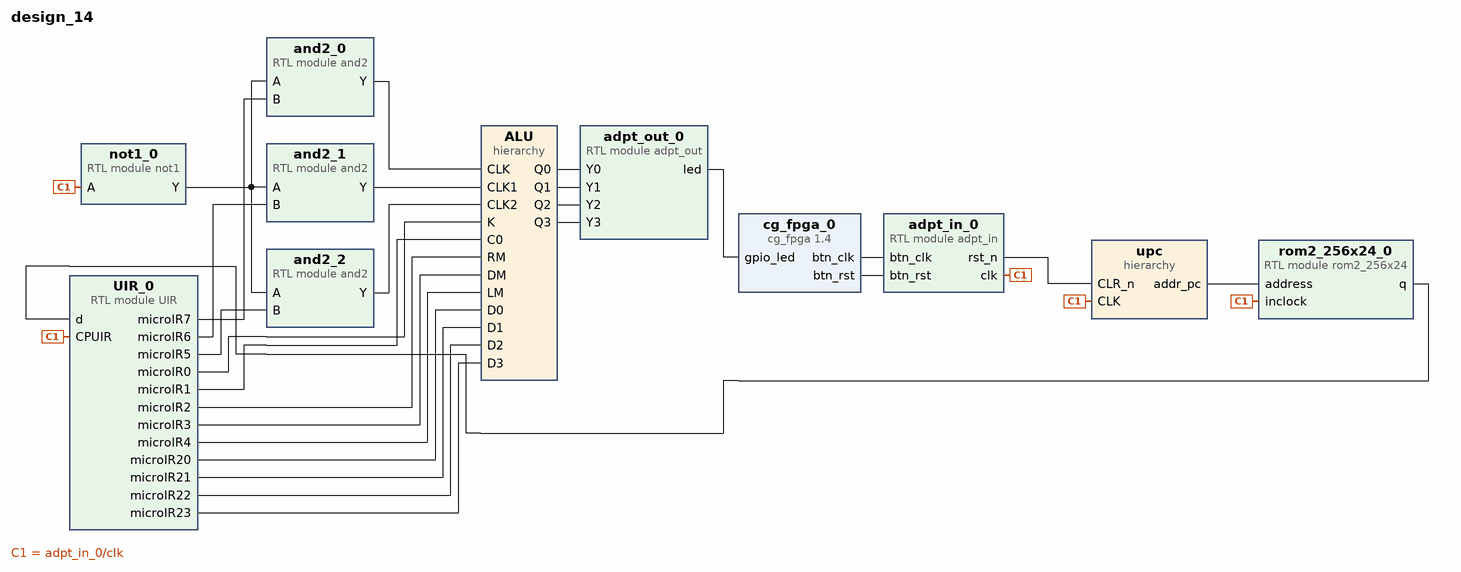
[diagram p0: block diagram of the top level]
# Vivado block design design_14, xc7z020clg400-1, Vivado 2024.2
create_bd_design design_14

create_bd_cell -type ip -vlnv educg.net:user:cg_fpga:1.4 cg_fpga_0
create_bd_cell -type module -reference rom2_256x24 rom2_256x24_0
create_bd_cell -type module -reference UIR UIR_0
create_bd_cell -type module -reference adpt_in adpt_in_0
create_bd_cell -type module -reference adpt_out adpt_out_0
create_bd_cell -type module -reference and2 and2_0
create_bd_cell -type module -reference not1 not1_0
create_bd_cell -type hier ALU
create_bd_cell -type hier upc
create_bd_cell -type module -reference and2 and2_1
create_bd_cell -type module -reference and2 and2_2

# ---- hierarchy /ALU ----
current_bd_instance /ALU
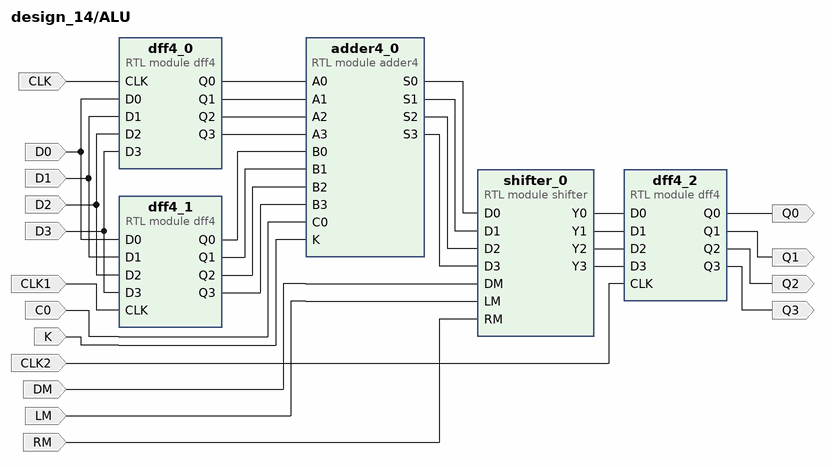
[diagram p1: block diagram inside /ALU]
create_bd_pin -dir I D0
create_bd_pin -dir I D1
create_bd_pin -dir I D2
create_bd_pin -dir I D3
create_bd_pin -dir I LM
create_bd_pin -dir I DM
create_bd_pin -dir I RM
create_bd_pin -dir I C0
create_bd_pin -dir I -type clk CLK
create_bd_pin -dir I -type clk CLK1
create_bd_pin -dir I -type clk CLK2
create_bd_pin -dir I K
create_bd_pin -dir O Q3
create_bd_pin -dir O Q2
create_bd_pin -dir O Q1
create_bd_pin -dir O Q0

create_bd_cell -type module -reference shifter shifter_0
create_bd_cell -type module -reference dff4 dff4_0
create_bd_cell -type module -reference adder4 adder4_0
create_bd_cell -type module -reference dff4 dff4_2
create_bd_cell -type module -reference dff4 dff4_1

# ---- hierarchy /upc ----
current_bd_instance /upc
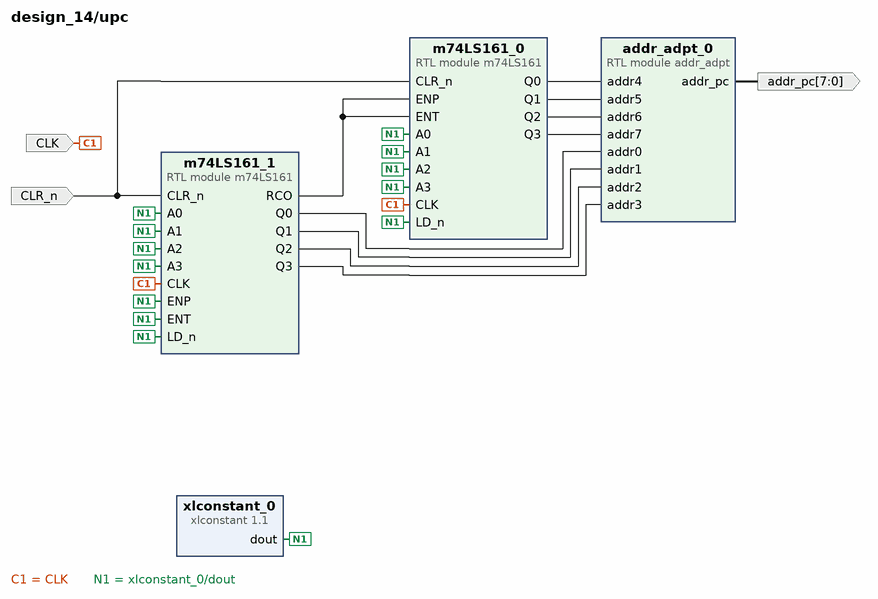
[diagram p2: block diagram inside /upc]
create_bd_pin -dir O -from 7 -to 0 addr_pc
create_bd_pin -dir I -type clk CLK
create_bd_pin -dir I CLR_n

create_bd_cell -type module -reference m74LS161 m74LS161_0
create_bd_cell -type module -reference addr_adpt addr_adpt_0
create_bd_cell -type module -reference m74LS161 m74LS161_1
create_bd_cell -type ip -vlnv xilinx.com:ip:xlconstant:1.1 xlconstant_0

# ---- connections ----

current_bd_instance /ALU
connect_bd_net -net C0_1 [get_bd_pins C0] [get_bd_pins adder4_0/C0]
connect_bd_net -net CLK1_1 [get_bd_pins CLK1] [get_bd_pins dff4_1/CLK]
connect_bd_net -net CLK2_1 [get_bd_pins CLK2] [get_bd_pins dff4_2/CLK]
connect_bd_net [get_bd_pins CLK] [get_bd_pins dff4_0/CLK]
connect_bd_net -net D0_1 [get_bd_pins D0] [get_bd_pins dff4_0/D0] [get_bd_pins dff4_1/D0]
connect_bd_net -net D1_1 [get_bd_pins D1] [get_bd_pins dff4_0/D1] [get_bd_pins dff4_1/D1]
connect_bd_net -net D2_1 [get_bd_pins D2] [get_bd_pins dff4_0/D2] [get_bd_pins dff4_1/D2]
connect_bd_net -net D3_1 [get_bd_pins D3] [get_bd_pins dff4_0/D3] [get_bd_pins dff4_1/D3]
connect_bd_net [get_bd_pins DM] [get_bd_pins shifter_0/DM]
connect_bd_net [get_bd_pins K] [get_bd_pins adder4_0/K]
connect_bd_net [get_bd_pins LM] [get_bd_pins shifter_0/LM]
connect_bd_net [get_bd_pins RM] [get_bd_pins shifter_0/RM]
connect_bd_net [get_bd_pins adder4_0/S0] [get_bd_pins shifter_0/D0]
connect_bd_net [get_bd_pins adder4_0/S1] [get_bd_pins shifter_0/D1]
connect_bd_net [get_bd_pins adder4_0/S2] [get_bd_pins shifter_0/D2]
connect_bd_net [get_bd_pins adder4_0/S3] [get_bd_pins shifter_0/D3]
connect_bd_net [get_bd_pins dff4_0/Q0] [get_bd_pins adder4_0/A0]
connect_bd_net [get_bd_pins dff4_0/Q1] [get_bd_pins adder4_0/A1]
connect_bd_net [get_bd_pins dff4_0/Q2] [get_bd_pins adder4_0/A2]
connect_bd_net [get_bd_pins dff4_0/Q3] [get_bd_pins adder4_0/A3]
connect_bd_net [get_bd_pins dff4_1/Q0] [get_bd_pins adder4_0/B0]
connect_bd_net [get_bd_pins dff4_1/Q1] [get_bd_pins adder4_0/B1]
connect_bd_net [get_bd_pins dff4_1/Q2] [get_bd_pins adder4_0/B2]
connect_bd_net [get_bd_pins dff4_1/Q3] [get_bd_pins adder4_0/B3]
connect_bd_net [get_bd_pins dff4_2/Q0] [get_bd_pins Q0]
connect_bd_net [get_bd_pins dff4_2/Q1] [get_bd_pins Q1]
connect_bd_net [get_bd_pins dff4_2/Q2] [get_bd_pins Q2]
connect_bd_net [get_bd_pins dff4_2/Q3] [get_bd_pins Q3]
connect_bd_net [get_bd_pins shifter_0/Y0] [get_bd_pins dff4_2/D0]
connect_bd_net [get_bd_pins shifter_0/Y1] [get_bd_pins dff4_2/D1]
connect_bd_net [get_bd_pins shifter_0/Y2] [get_bd_pins dff4_2/D2]
connect_bd_net [get_bd_pins shifter_0/Y3] [get_bd_pins dff4_2/D3]

current_bd_instance /upc
connect_bd_net [get_bd_pins CLK] [get_bd_pins m74LS161_0/CLK] [get_bd_pins m74LS161_1/CLK]
connect_bd_net [get_bd_pins CLR_n] [get_bd_pins m74LS161_0/CLR_n] [get_bd_pins m74LS161_1/CLR_n]
connect_bd_net [get_bd_pins addr_adpt_0/addr_pc] [get_bd_pins addr_pc]
connect_bd_net [get_bd_pins m74LS161_0/Q0] [get_bd_pins addr_adpt_0/addr4]
connect_bd_net [get_bd_pins m74LS161_0/Q1] [get_bd_pins addr_adpt_0/addr5]
connect_bd_net [get_bd_pins m74LS161_0/Q2] [get_bd_pins addr_adpt_0/addr6]
connect_bd_net [get_bd_pins m74LS161_0/Q3] [get_bd_pins addr_adpt_0/addr7]
connect_bd_net [get_bd_pins m74LS161_1/Q0] [get_bd_pins addr_adpt_0/addr0]
connect_bd_net [get_bd_pins m74LS161_1/Q1] [get_bd_pins addr_adpt_0/addr1]
connect_bd_net [get_bd_pins m74LS161_1/Q2] [get_bd_pins addr_adpt_0/addr2]
connect_bd_net [get_bd_pins m74LS161_1/Q3] [get_bd_pins addr_adpt_0/addr3]
connect_bd_net [get_bd_pins m74LS161_1/RCO] [get_bd_pins m74LS161_0/ENP] [get_bd_pins m74LS161_0/ENT]
connect_bd_net [get_bd_pins xlconstant_0/dout] \
  [get_bd_pins m74LS161_0/LD_n] [get_bd_pins m74LS161_0/A3] [get_bd_pins m74LS161_0/A2] [get_bd_pins m74LS161_0/A1] \
  [get_bd_pins m74LS161_0/A0] [get_bd_pins m74LS161_1/ENP] [get_bd_pins m74LS161_1/ENT] [get_bd_pins m74LS161_1/LD_n] \
  [get_bd_pins m74LS161_1/A3] [get_bd_pins m74LS161_1/A2] [get_bd_pins m74LS161_1/A1] [get_bd_pins m74LS161_1/A0]

current_bd_instance /
connect_bd_net [get_bd_pins ALU/Q0] [get_bd_pins adpt_out_0/Y0]
connect_bd_net [get_bd_pins ALU/Q1] [get_bd_pins adpt_out_0/Y1]
connect_bd_net [get_bd_pins ALU/Q2] [get_bd_pins adpt_out_0/Y2]
connect_bd_net [get_bd_pins ALU/Q3] [get_bd_pins adpt_out_0/Y3]
connect_bd_net [get_bd_pins UIR_0/microIR0] [get_bd_pins ALU/K]
connect_bd_net [get_bd_pins UIR_0/microIR1] [get_bd_pins ALU/C0]
connect_bd_net [get_bd_pins UIR_0/microIR2] [get_bd_pins ALU/RM]
connect_bd_net [get_bd_pins UIR_0/microIR3] [get_bd_pins ALU/DM]
connect_bd_net [get_bd_pins UIR_0/microIR4] [get_bd_pins ALU/LM]
connect_bd_net [get_bd_pins UIR_0/microIR5] [get_bd_pins and2_2/B]
connect_bd_net [get_bd_pins UIR_0/microIR6] [get_bd_pins and2_1/B]
connect_bd_net [get_bd_pins UIR_0/microIR7] [get_bd_pins and2_0/B]
connect_bd_net [get_bd_pins UIR_0/microIR20] [get_bd_pins ALU/D0]
connect_bd_net [get_bd_pins UIR_0/microIR21] [get_bd_pins ALU/D1]
connect_bd_net [get_bd_pins UIR_0/microIR22] [get_bd_pins ALU/D2]
connect_bd_net [get_bd_pins UIR_0/microIR23] [get_bd_pins ALU/D3]
connect_bd_net [get_bd_pins adpt_in_0/clk] [get_bd_pins upc/CLK] [get_bd_pins UIR_0/CPUIR] [get_bd_pins not1_0/A] [get_bd_pins rom2_256x24_0/inclock]
connect_bd_net [get_bd_pins adpt_in_0/rst_n] [get_bd_pins upc/CLR_n]
connect_bd_net [get_bd_pins adpt_out_0/led] [get_bd_pins cg_fpga_0/gpio_led]
connect_bd_net [get_bd_pins and2_0/Y] [get_bd_pins ALU/CLK]
connect_bd_net [get_bd_pins and2_1/Y] [get_bd_pins ALU/CLK1]
connect_bd_net [get_bd_pins and2_2/Y] [get_bd_pins ALU/CLK2]
connect_bd_net [get_bd_pins cg_fpga_0/btn_clk] [get_bd_pins adpt_in_0/btn_clk]
connect_bd_net [get_bd_pins cg_fpga_0/btn_rst] [get_bd_pins adpt_in_0/btn_rst]
connect_bd_net [get_bd_pins not1_0/Y] [get_bd_pins and2_0/A] [get_bd_pins and2_1/A] [get_bd_pins and2_2/A]
connect_bd_net [get_bd_pins rom2_256x24_0/q] [get_bd_pins UIR_0/d]
connect_bd_net [get_bd_pins upc/addr_pc] [get_bd_pins rom2_256x24_0/address]

validate_bd_design
save_bd_design
